# EAGLE design me433_hw4 (EAGLE 9.6.2)
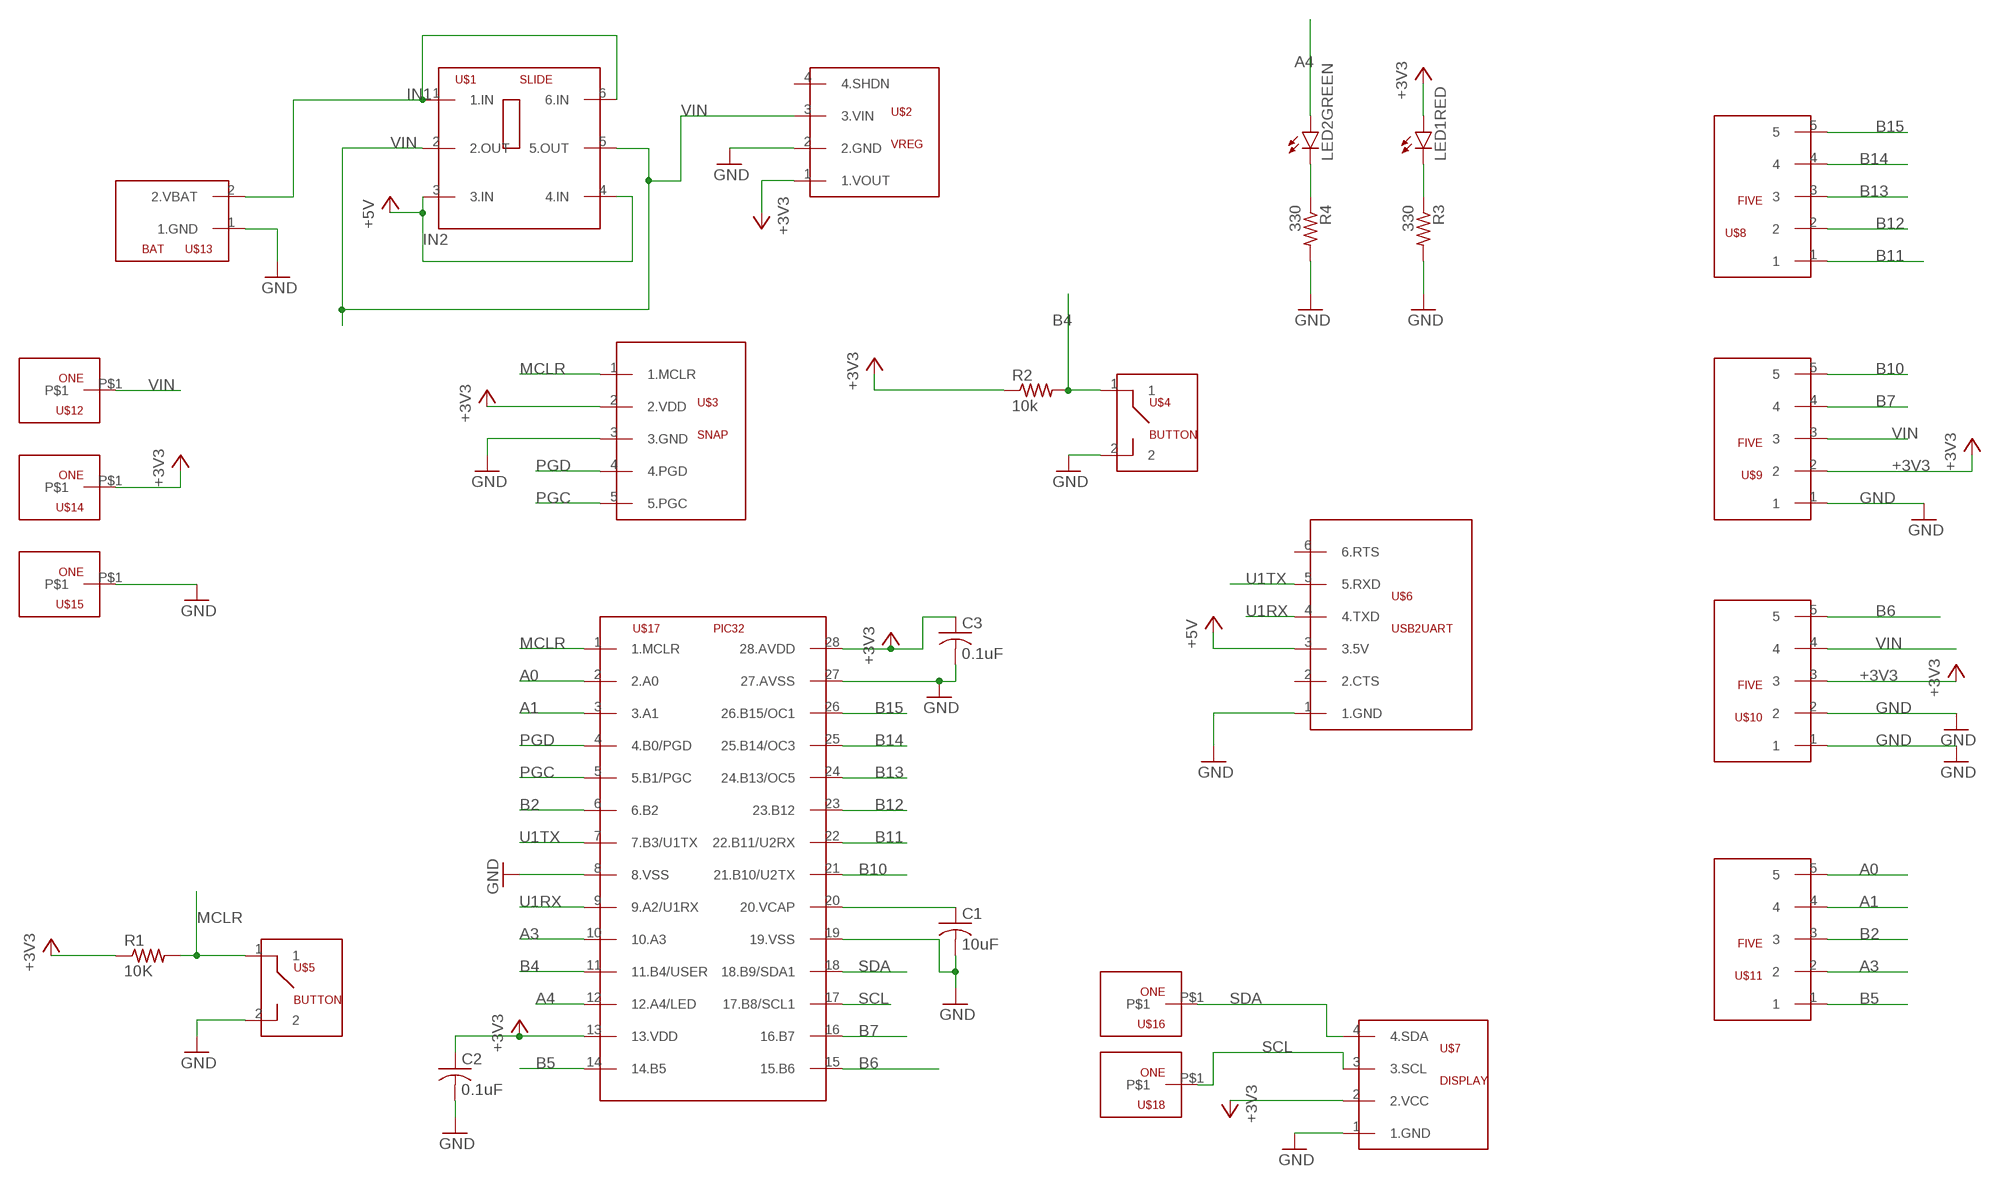
[diagram p0: schematic, sheet 1]

## Parts
C1  10uF  C-US025-024X044  [C025-024X044]
C2  0.1uF  C-US025-024X044  [C025-024X044]
C3  0.1uF  C-US025-024X044  [C025-024X044]
LED1RED  LED3MM  [LED3MM]
LED2GREEN  LED3MM  [LED3MM]
R1  10K  R-US_0204/5  [0204/5]
R2  10k  R-US_0204/5  [0204/5]
R3  330  R-US_0204/5  [0204/5]
R4  330  R-US_0204/5  [0204/5]
U$1  SLIDE  [SLIDE]
U$2  VREG  [VREG]
U$3  SNAP  [SNAP]
U$4  BUTTON  [BUTTON]
U$5  BUTTON  [BUTTON]
U$6  USB2UART  [USB2UART]
U$7  DISPLAY  [DISPLAY]
U$8  FIVE  [FIVE]
U$9  FIVE  [FIVE]
U$10  FIVE  [FIVE]
U$11  FIVE  [FIVE]
U$12  ONE  [ONE]
U$13  BAT  [BAT]
U$14  ONE  [ONE]
U$15  ONE  [ONE]
U$16  ONE  [ONE]
U$17  PIC32  [DIL28-3]
U$18  ONE  [ONE]

## Nets
+3V3: C2.1 C3.1 LED1RED.A R1.1 R2.1 U$2.1(1.VOUT) U$3.2(2.VDD) U$7.2(2.VCC) U$9.2 U$10.3 U$14.P$1 U$17.13(13.VDD) U$17.28(28.AVDD)
+5V: U$6.3(3.5V)
A0: U$11.5 U$17.2(2.A0)
A1: U$11.4 U$17.3(3.A1)
A3: U$11.2 U$17.10(10.A3)
A4: LED2GREEN.A U$17.12(12.A4/LED)
B2: U$11.3 U$17.6(6.B2)
B4: R2.2 U$4.1 U$17.11(11.B4/USER)
B5: U$11.1 U$17.14(14.B5)
B6: U$10.5 U$17.15(15.B6)
B7: U$9.4 U$17.16(16.B7)
B10: U$9.5 U$17.21(21.B10/U2TX)
B11: U$8.1 U$17.22(22.B11/U2RX)
B12: U$8.2 U$17.23(23.B12)
B13: U$8.3 U$17.24(24.B13/OC5)
B14: U$8.4 U$17.25(25.B14/OC3)
B15: U$8.5 U$17.26(26.B15/OC1)
GND: C1.2 C2.2 C3.2 R3.2 R4.2 U$2.2(2.GND) U$3.3(3.GND) U$4.2 U$5.2 U$6.1(1.GND) U$7.1(1.GND) U$9.1 U$10.1 U$10.2 U$13.1(1.GND) U$15.P$1 U$17.8(8.VSS) U$17.19(19.VSS) U$17.27(27.AVSS)
IN1: U$1.1(1.IN) U$1.6(6.IN) U$13.2(2.VBAT)
IN2: U$1.3(3.IN) U$1.4(4.IN) ; supply symbol labelled +5V
MCLR: R1.2 U$3.1(1.MCLR) U$5.1 U$17.1(1.MCLR)
N$1: LED2GREEN.K(C) R4.1
N$2: LED1RED.K(C) R3.1
N$22: C1.1 U$17.20(20.VCAP)
PGC: U$3.5(5.PGC) U$17.5(5.B1/PGC)
PGD: U$3.4(4.PGD) U$17.4(4.B0/PGD)
SCL: U$7.3(3.SCL) U$17.17(17.B8/SCL1) U$18.P$1
SDA: U$7.4(4.SDA) U$16.P$1 U$17.18(18.B9/SDA1)
U1RX: U$6.4(4.TXD) U$17.9(9.A2/U1RX)
U1TX: U$6.5(5.RXD) U$17.7(7.B3/U1TX)
VIN: U$1.2(2.OUT) U$1.5(5.OUT) U$2.3(3.VIN) U$9.3 U$10.4 U$12.P$1
Unconnected: U$2.4(4.SHDN) U$6.2(2.CTS) U$6.6(6.RTS)

## Library data of the parts
C1-C3 = pic32:C-US: CAPACITOR, American symbol; SPICEPREFIX: C
LED1RED LED2GREEN = pic32:LED: LED OSRAM: - CHIPLED LG R971, LG N971, LY N971, LG Q971, LY Q971, LO R971, LY R971 LH N974, LH R974 LS Q976, LO Q976, LY Q976 LO Q996 - Hyper CHIPLED LW Q18S LB Q993, LB Q99A, LB R99A - SideLED LS A670, LO A670, LY A670, LG A670, LP A670 LB A673, LV A673, LT A673, LW A673 LH A674 LY A675 LS A676, LA A676, LO A676, LY A676, LW A676 LS A679, LY A679, LG A679 - Hyper Micro SIDELED® LS Y876, LA Y876, LO Y876, LY Y876 LT Y87S - SmartLED LW L88C, LW L88S LB L89C, LB L89S, LG L890 LS L89K, LO L89K, LY L89K LS L896, LA L896, LO L896, LY L896 - TOPLED LS T670, LO T670, LY T670, LG T670, LP T670 LSG T670, LSP T670, LSY T670, LOP T670, LYG T670 LG T671, LOG T671, LSG T671 LB T673, LV T673, LT T673, LW T673 LH T674 LS T676, LA T676, LO T676, LY T676, LB T676, LH T676, LSB T676, LW T676 LB T67C, LV T67C, LT T67C, LS T67K, LO T67K, LY T67K, LW E67C LS E67B, LA E67B, LO E67B, LY E67B, LB E67C, LV E67C, LT E67C LW T67C LS T679, LY T679, LG T679 LS T770, LO T770, LY T770, LG T770, LP T770 LB T773, LV T773, LT T773, LW T773 LH T774 LS E675, LA E675, LY E675, LS T675 LS T776, LA T776, LO T776, LY T776, LB T776 LHGB T686 LT T68C, LB T68C - Hyper Mini TOPLED® LB M676 - Mini TOPLED Santana® LG M470 LS M47K, LO M47K, LY M47K Source: http://www.osram.convergy.de LUXEON: - LUMILED® LXK2-PW12-R00, LXK2-PW12-S00, LXK2-PW14-U00, LXK2-PW14-V00 LXK2-PM12-R00, LXK2-PM12-S00, LXK2-PM14-U00 LXK2-PE12-Q00, LXK2-PE12-R00, LXK2-PE12-S00, LXK2-PE14-T00, LXK2-PE14-U00 LXK2-PB12-K00, LXK2-PB12-L00, LXK2-PB12-M00, LXK2-PB14-N00, LXK2-PB14-P00, LXK2-PB14-Q00 LXK2-PR12-L00, LXK2-PR12-M00, LXK2-PR14-Q00, LXK2-PR14-R00 LXK2-PD12-Q00, LXK2-PD12-R00, LXK2-PD12-S00 LXK2-PH12-R00, LXK2-PH12-S00 LXK2-PL12-P00, LXK2-PL12-Q00, LXK2-PL12-R00 Source: www.luxeon.com KINGBRIGHT: KA-3528ASYC Source: www.kingbright.com
R1-R4 = pic32:R-US_: RESISTOR, American symbol; SPICEPREFIX: R
U$1 = pic32:SLIDE
U$2 = pic32:VREG
U$3 = pic32:SNAP
U$4 U$5 = pic32:BUTTON
U$6 = pic32:USB2UART
U$7 = pic32:DISPLAY
U$8-U$11 = pic32:FIVE
U$12 U$14-U$16 U$18 = pic32:ONE
U$13 = pic32:BAT
U$17 = pic32:PIC32

## Board
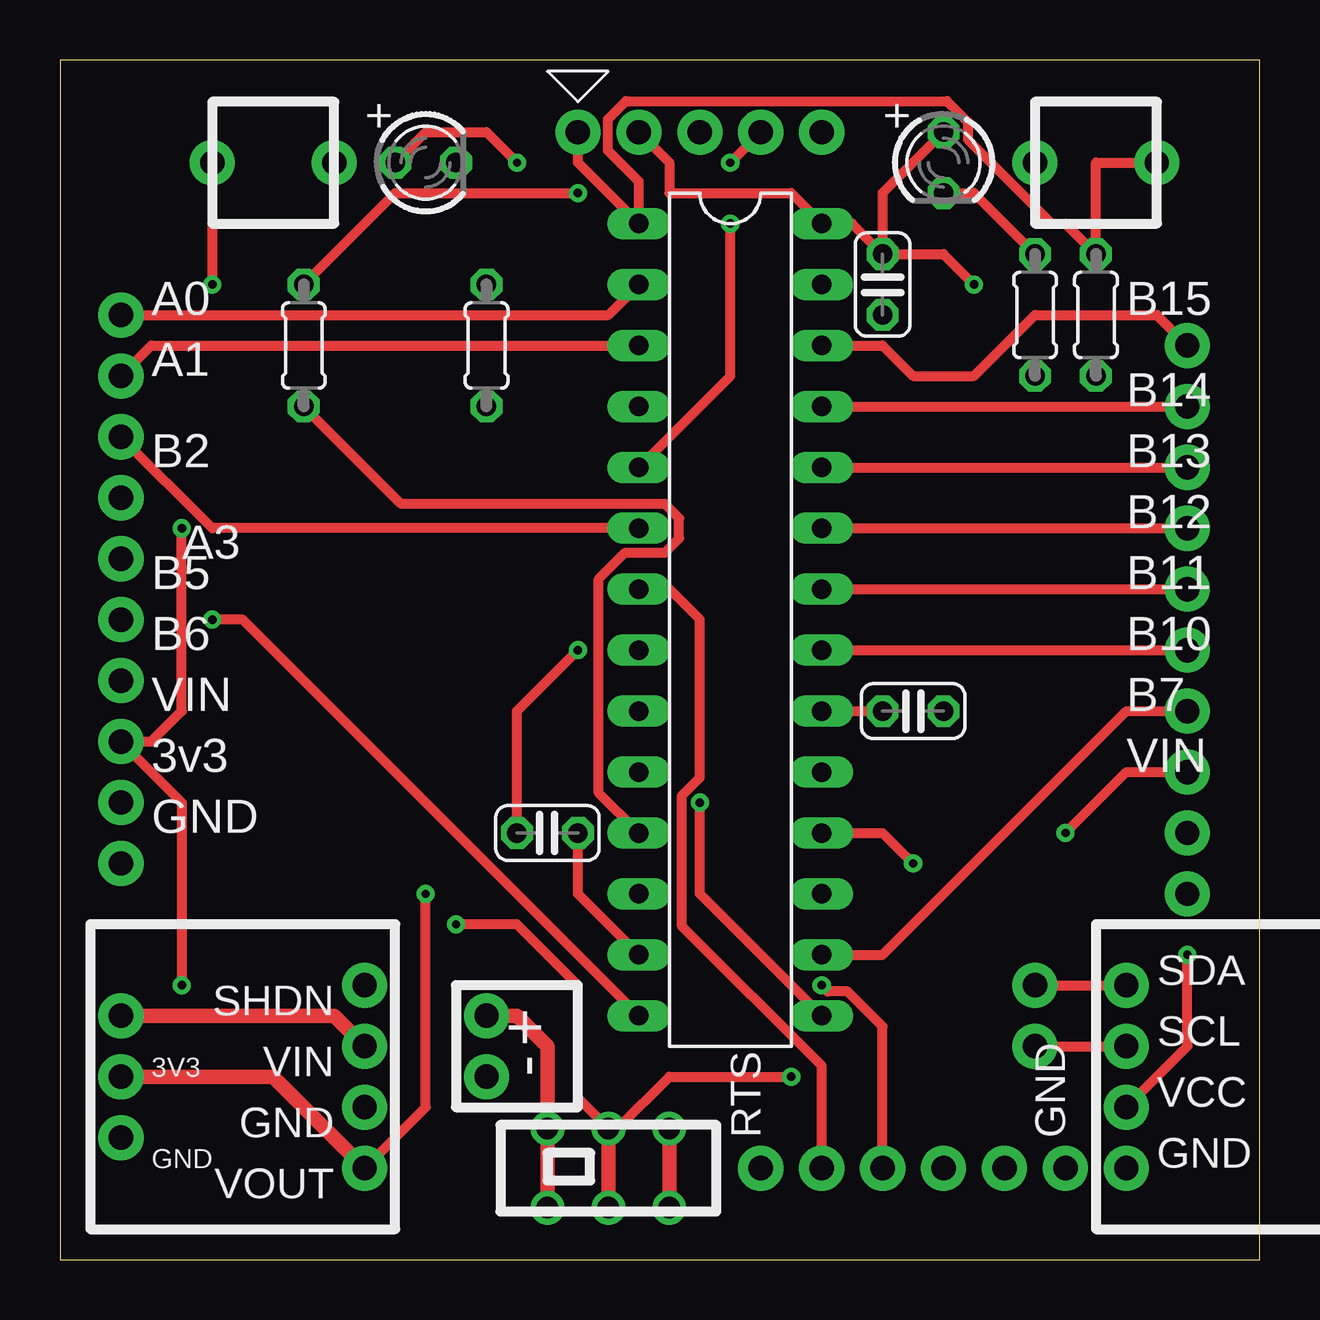
[diagram p1: board, top side]
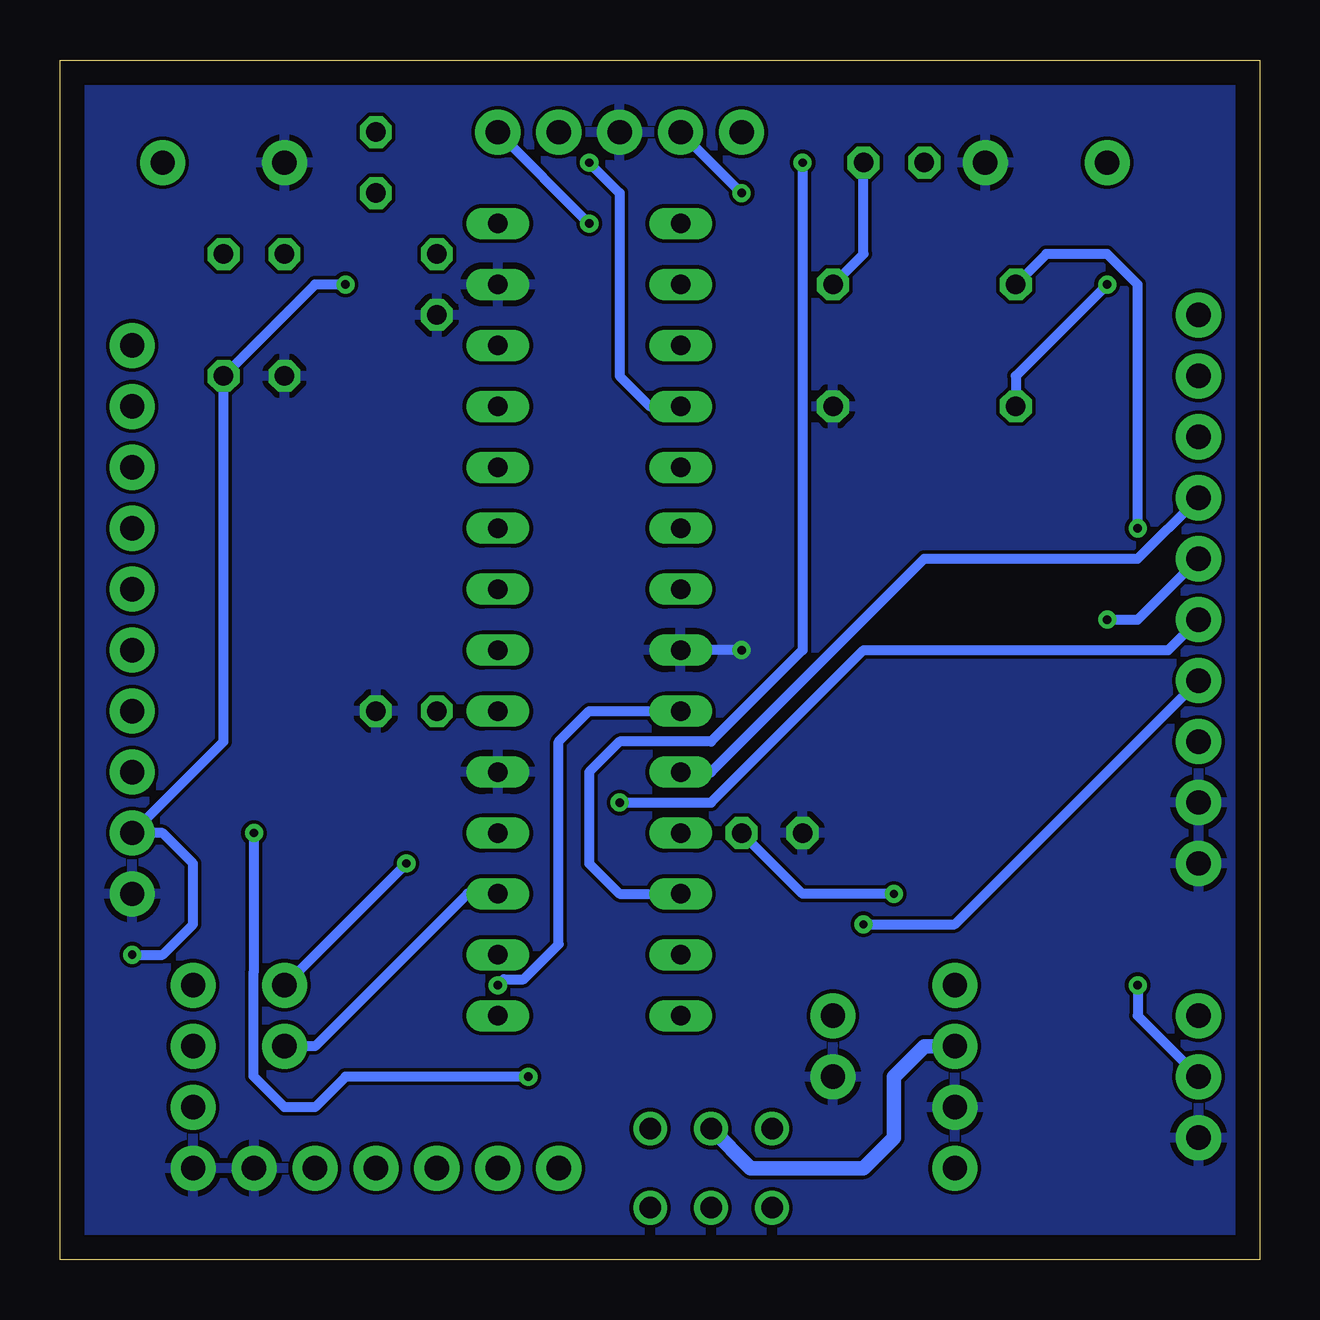
[diagram p2: board, bottom side, seen from below]

Size 50 x 50 mm. Coordinates in mm from the lower left corner, seen from the top.
Outline: 0,0 50,0 50,50 0,50 0,0
Copper layers (1*16): Top 0.035mm / dielectric 1.5mm / Bottom 0.035mm
Design rules "default": minimum track width 6mil, minimum drill 0.35mm, track to track 6mil, track to pad 6mil, pad to pad 6mil, via to via 6mil, smd to smd 6mil, copper to edge 40mil, drill to drill 6mil, minimum pad ring 10mil, minimum via ring 8mil, stop-mask expansion 4mil, vias tented up to drill 0mil, thermal gap 10mil

### Footprints (pad centres in the part's own frame; a part is rotated, then mirrored left to right if it is on the bottom)
C025-024X044 = drill 0.813 octagon: 1 -1.27,0; 2 1.27,0
LED3MM = drill 0.813 octagon: A -1.27,0; K 1.27,0
0204/5 = drill 0.813 octagon: 1 -2.54,0; 2 2.54,0
SLIDE = drill 0.9: 1 -2.54,-1.65; 2 0,-1.65; 3 2.54,-1.65; 4 2.54,1.65; 5 0,1.65; 6 -2.54,1.65
VREG = drill 1.016 pad 1.88: 1 -3.81,0; 2 -1.27,0; 3 1.27,0; 4 3.81,0
SNAP = drill 1.016 pad 1.88: 1 -5.08,0; 2 -2.54,0; 3 0,0; 4 2.54,0; 5 5.08,0
BUTTON = drill 1.016 pad 1.88: 1 -2.54,0; 2 2.54,0
USB2UART = drill 1.016 pad 1.88: 1 -6.35,0; 2 -3.81,0; 3 -1.27,0; 4 1.27,0; 5 3.81,0; 6 6.35,0
DISPLAY = drill 1.016 pad 1.88: 1 0,-3.81; 2 0,-1.27; 3 0,1.27; 4 0,3.81
FIVE = drill 1.016 pad 1.88: 1 -5.08,0; 2 -2.54,0; 3 0,0; 4 2.54,0; 5 5.08,0
ONE = drill 1.016 pad 1.88: P$1 0,0
BAT = drill 1.016 pad 1.88: 1 -1.27,0; 2 1.27,0
DIL28-3 = drill 0.813 long: 1 -16.51,-3.81; 2 -13.97,-3.81; 3 -11.43,-3.81; 4 -8.89,-3.81; 5 -6.35,-3.81; 6 -3.81,-3.81; 7 -1.27,-3.81; 8 1.27,-3.81; 9 3.81,-3.81; 10 6.35,-3.81; 11 8.89,-3.81; 12 11.43,-3.81; 13 13.97,-3.81; 14 16.51,-3.81; 15 16.51,3.81; 16 13.97,3.81; 17 11.43,3.81; 18 8.89,3.81; 19 6.35,3.81; 20 3.81,3.81; 21 1.27,3.81; 22 -1.27,3.81; 23 -3.81,3.81; 24 -6.35,3.81; 25 -8.89,3.81; 26 -11.43,3.81; 27 -13.97,3.81; 28 -16.51,3.81

### Placement (x,y rotation side)
C1  35.56,22.86 0 top
C2  34.29,40.64 270 top
C3  20.32,17.78 180 top
LED1RED  36.83,45.72 270 top
LED2GREEN  15.24,45.72 0 top
R1  43.18,39.37 90 top
R2  10.16,38.1 270 top
R3  40.64,39.37 270 top
R4  17.78,38.1 270 top
U$1  22.86,3.81 0 top
U$2  12.7,7.62 90 top
U$3  26.67,46.99 0 top
U$4  8.89,45.72 0 top
U$5  43.18,45.72 180 top
U$6  35.56,3.81 180 top
U$7  44.45,7.62 0 top
U$8  46.99,33.02 90 top
U$9  46.99,20.32 90 top
U$10  2.54,21.59 90 top
U$11  2.54,34.29 90 top
U$12  2.54,10.16 0 top
U$13  17.78,8.89 90 top
U$14  2.54,7.62 0 top
U$15  2.54,5.08 0 top
U$16  40.64,11.43 0 top
U$17  27.94,26.67 270 top
U$18  40.64,8.89 0 top

### Tracks (layer width: path | path; a pad name or v marks a point on that pad's centre or on a via)
+3V3  (via drill 0.35)
  Top 0.406: U$17.13 21.59,15.24 C3.1 | U$3.2 25.4,45.72 25.4,44.45 30.48,44.45 U$17.28 33.02,43.18 C2.1 | R2.1 13.97,44.45 v21.59,44.45 | LED1RED.A 34.29,44.45 C2.1 | U$7.2 46.99,8.89 v46.99,12.7 | v5.08,11.43 5.08,19.05 U$10.3 3.81,21.59 5.08,22.86 v5.08,30.48 | U$2.1 15.24,6.35 v15.24,15.24 | C2.1 36.83,41.91 v38.1,40.64
  Top 0.61: U$14.P$1 8.89,7.62 U$2.1
  Bottom 0.406: v21.59,44.45 U$3.2 | v46.99,12.7 45.72,12.7 44.45,13.97 44.45,16.51 45.72,17.78 U$9.2 43.18,21.59 R1.1 39.37,40.64 v38.1,40.64 | v5.08,11.43 5.08,10.16 U$14.P$1 | v15.24,15.24 19.05,15.24 C3.1 | v5.08,30.48 5.08,40.64 6.35,41.91 8.89,41.91 R2.1
A0
  Top 0.406: U$11.5 22.86,39.37 U$17.2
A1
  Top 0.406: U$11.4 3.81,38.1 U$17.3
A3
  Bottom 0.406: U$17.10 22.86,20.32 13.97,29.21 5.08,29.21 U$11.2
A4  (via drill 0.35)
  Top 0.406: LED2GREEN.A 15.24,46.99 17.78,46.99 v19.05,45.72
  Bottom 0.406: v19.05,45.72 19.05,25.4 22.86,21.59 26.67,21.59 27.94,20.32 27.94,16.51 26.67,15.24 U$17.12
B2
  Top 0.406: U$17.6 6.35,30.48 U$11.3
B4  (via drill 0.35)
  Top 0.406: U$4.1 v6.35,40.64 | U$17.11 22.45,19.46 22.45,28.36 23.56,29.46 25.21,29.46 25.81,30.06 25.81,30.9 25.21,31.5 14.22,31.5 R2.2
  Bottom 0.406: v6.35,40.64 10.16,36.83 R2.2
B5  (via drill 0.35)
  Top 0.406: U$17.14 7.62,26.67 v6.35,26.67
  Bottom 0.406: v6.35,26.67 5.08,26.67 U$11.1
B6  (via drill 0.35)
  Top 0.406: U$17.15 26.67,15.24 v26.67,19.05
  Bottom 0.406: v26.67,19.05 22.86,19.05 16.51,25.4 3.81,25.4 U$10.5
B7
  Top 0.406: U$17.16 34.29,12.7 44.45,22.86 U$9.4
B10
  Top 0.406: U$17.21 U$9.5
B11
  Top 0.406: U$17.22 U$8.1
B12
  Top 0.406: U$17.23 U$8.2
B13
  Top 0.406: U$17.24 U$8.3
B14
  Top 0.406: U$17.25 U$8.4
B15
  Top 0.406: U$17.26 34.29,38.1 35.56,36.83 38.1,36.83 40.64,39.37 45.72,39.37 U$8.5
GND  (via drill 0.35)
  Top 0.406: C3.2 19.05,22.86 v21.59,25.4
  Bottom 0.406: v21.59,25.4 U$17.8
  pour Bottom: 0,0 50.8,0 50.8,50.8 0,50.8
IN1
  Top 0.61: U$1.1 20.32,5.08 U$1.6 20.32,8.89 19.05,10.16 U$13.2
IN2
  Top 0.61: U$1.4 U$1.3
MCLR
  Top 0.406: U$3.1 21.59,45.72 U$17.1 24.13,44.93 22.84,46.23 22.84,47.53 23.59,48.28 36.97,48.28 37.85,47.41 37.85,46.68 41.35,43.18 41.91,43.18 R1.2 43.18,45.72 U$5.1
N$1
  Bottom 0.406: R4.1 16.51,41.91 LED2GREEN.K
N$2
  Top 0.406: LED1RED.K 38.1,44.45 R3.1
N$22
  Top 0.406: U$17.20 C1.1
PGC  (via drill 0.35)
  Top 0.406: U$17.5 27.94,36.83 v27.94,43.18
  Bottom 0.406: v27.94,43.18 U$3.5
PGD  (via drill 0.35)
  Top 0.406: U$3.4 v27.94,45.72
  Bottom 0.406: v27.94,45.72 26.67,44.45 26.67,36.83 25.4,35.56 U$17.4
SCL
  Top 0.406: U$18.P$1 U$7.3
  Bottom 0.406: U$17.17 33.02,15.24 39.37,8.89 U$18.P$1
SDA  (via drill 0.35)
  Top 0.406: U$17.18 34.29,17.78 v35.56,16.51 | U$16.P$1 U$7.4
  Bottom 0.406: v35.56,16.51 U$16.P$1
U1RX  (via drill 0.35)
  Top 0.406: v31.75,11.43 32,11.18 32.83,11.18 34.29,9.72 U$6.4
  Bottom 0.406: v31.75,11.43 31.5,11.68 30.67,11.68 29.21,13.14 29.21,21.59 27.94,22.86 U$17.9
U1TX
  Top 0.406: U$6.5 31.75,8.06 25.94,13.88 25.94,19.35 26.67,20.09 26.67,26.67 25.4,27.94 U$17.7
VIN  (via drill 0.35)
  Top 0.406: v16.51,13.97 19.05,13.97 21.59,11.43 21.59,6.73 U$1.5 23.24,5.46 25.4,7.62 v30.48,7.62 | v41.91,17.78 44.45,20.32 U$9.3
  Top 0.61: U$12.P$1 11.43,10.16 U$2.3 | U$1.5 U$1.2
  Bottom 0.406: v16.51,13.97 12.7,13.97 U$10.4 | v41.91,17.78 41.91,11.99 41.94,11.97 41.94,7.64 40.64,6.35 39.37,6.35 38.1,7.62 v30.48,7.62
  Bottom 0.61: U$1.5 21.21,3.81 16.51,3.81 15.24,5.08 15.24,7.62 13.97,8.89 U$2.3

### Text on the board
tPlace: + | + | A0 | B15 | A1 | B14 | B2 | B13 | B12 | A3 | B5 | B11 | B6 | B10 | VIN | B7 | 3v3 | VIN | GND | 3V3 | GND